# Altium schematic sheet Inputs.SchDoc: Inputs
size A4; SheetNumber: 6; SheetTotal: 6
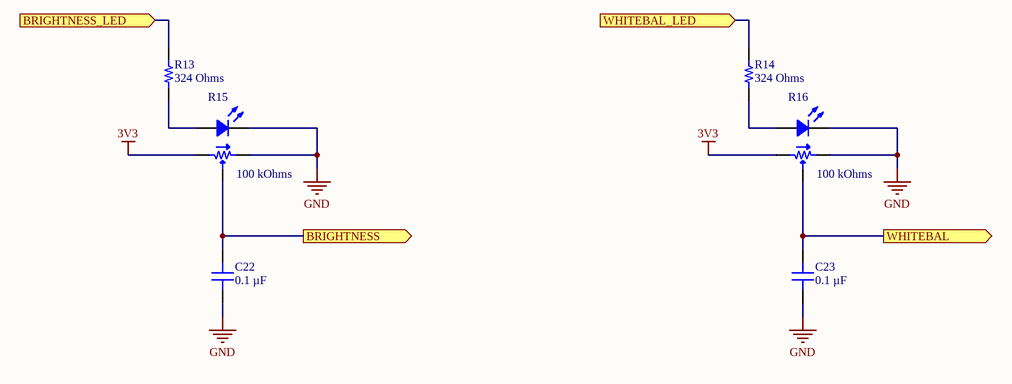
[diagram p0: Inputs.SchDoc]

## Parts
C22  0.1 µF  [CAP 0603_1608]
C23  0.1 µF  [CAP 0603_1608]
R13  324 Ohms  [RES 0603_1608]
R14  324 Ohms  [RES 0603_1608]
R15  Resistance: 100 kOhms  [POT BOURNS PTL45-15xx]  (hidden comment: PTL45-15O0-104B1)
R16  Resistance: 100 kOhms  [POT BOURNS PTL45-15xx]  (hidden comment: PTL45-15O0-104B1)

## Ports
BRIGHTNESS (out), BRIGHTNESS_LED (in), WHITEBAL (out), WHITEBAL_LED (in)

## Nets
3V3: R15.1 R16.1
GND: C22.1 C23.1 R15.3 R15.E R16.3 R16.E
BRIGHTNESS: C22.2 R15.2 ; port BRIGHTNESS
BRIGHTNESS_LED: R13.2 ; port BRIGHTNESS_LED
WHITEBAL: C23.2 R16.2 ; port WHITEBAL
WHITEBAL_LED: R14.2 ; port WHITEBAL_LED
NetR13_1: R13.1 R15.B
NetR14_1: R14.1 R16.B

## Notes on the sheet
- Title
- Size:
- Date:
- A4
- Number:
- Time:
- Revision:
- Sheet
- of
- File:

## Library data of the parts
C22 C23 = CC0603KRX7R6BB104: CAP CER 0.1UF 10V X7R 0603; manufacturer: Yageo; Tolerance: ±10%; Part Number: CC0603KRX7R6BB104; Value: 0.1 µF; Applications: General Purpose; Capacitance: 0.1 µF; componentlink1description: Datasheet; componentlink1url: https://www.yageo.com/upload/media/product/productsearch/datasheet/mlcc/UPY-GPHC_X7R_6.3V-to-50V_18.pdf; componentlink2description: DigiKey Link; componentlink2url: https://www.digikey.com/en/products/detail/yageo/CC0603KRX7R6BB104/5883741; Device Package: 0603 (1608 Metric); lastupdated: 16/03/2022 06:22:39; Lifecycle Status: Active; Minimum Order: 1; Mounting Type: Surface Mount, MLCC; Operating Temperature: -55°C ~ 125°C; Package / Case: 0603 (1608 Metric); packaging: TapeAndReel; partid: 7937; Part Status: Active; price: 0.01; series: CC; Size / Dimension: 0.063" L x 0.031" W (1.60mm x 0.80mm); Supplier 1: DigiKey; Supplier Part Number 1: 311-4055-1-ND; Temperature Coefficient: X7R; Thickness (Max): 0.035" (0.90mm); Voltage - Rated: 10V
R13 R14 = ERJ-3EKF3240V: RES SMD 324 OHM 1% 1/10W 0603; Manufacturer: Panasonic Electronic Components; Power (Watts): 0.1W, 1/10W; Temperature Coefficient: ±100ppm/°C; Part Number: ERJ-3EKF3240V; Value: 324 Ohms; ComponentLink1Description: Datasheet; ComponentLink1URL: https://industrial.panasonic.com/cdbs/www-data/pdf/RDA0000/AOA0000C304.pdf; ComponentLink2Description: DigiKey Link; ComponentLink2URL: https://www.digikey.com/en/products/detail/panasonic-electronic-components/ERJ-3EKF3240V/196295; Composition: Thick Film; Device Package: 0603 (1608 Metric); Features: Automotive AEC-Q200; Height - Seated (Max): 0.022" (0.55mm); LastUpdated: 21/03/2022 18:33:03; Lifecycle Status: Active; Minimum Order: 1; Number of Terminations: 2; Operating Temperature: -55°C ~ 155°C; Package / Case: 0603 (1608 Metric); Packaging: TapeAndReel; PartId: 26113; Part Status: Active; Price: 0.01; Ratings: AEC-Q200; Resistance: 324 Ohms; Series: ERJ-3EK; Size / Dimension: 0.063" L x 0.031" W (1.60mm x 0.80mm); Supplier 1: DigiKey; Supplier Part Number 1: P324HCT-ND; Supplier Device Package: 0603; Tolerance: ±1%
R15 R16 = PTL45-15O0-104B1: SLIDE POT 100K OHM 0.125W TOP; Manufacturer: Bourns Inc.; Fader Type: Standard, LED; Power (Watts): 0.125W, 1/8W; Tolerance: ±20%; Travel Range: 45mm; Part Number: PTL45-15O0-104B1; Adjustment Type: Top; ComponentLink1Description: Datasheet; ComponentLink1URL: https://www.bourns.com/docs/Product-Datasheets/PTL.pdf; ComponentLink2Description: DigiKey Link; ComponentLink2URL: https://www.digikey.com/en/products/detail/bourns-inc/PTL45-15O0-104B1/3781311; LastUpdated: 21/03/2022 16:30:02; Lifecycle Status: Active; Minimum Order: 1; Mounting Type: Through Hole; Packaging: Bulk; Part Status: Active; Price: 1.14; Series: Pro Audio PTL; Size / Dimension: Rectangular - 2.362" L x 0.354" W x 0.276" H (60.00mm x 9.00mm x 7.00mm); Supplier 1: DigiKey; Supplier Part Number 1: PTL45-15O0-104B1-ND